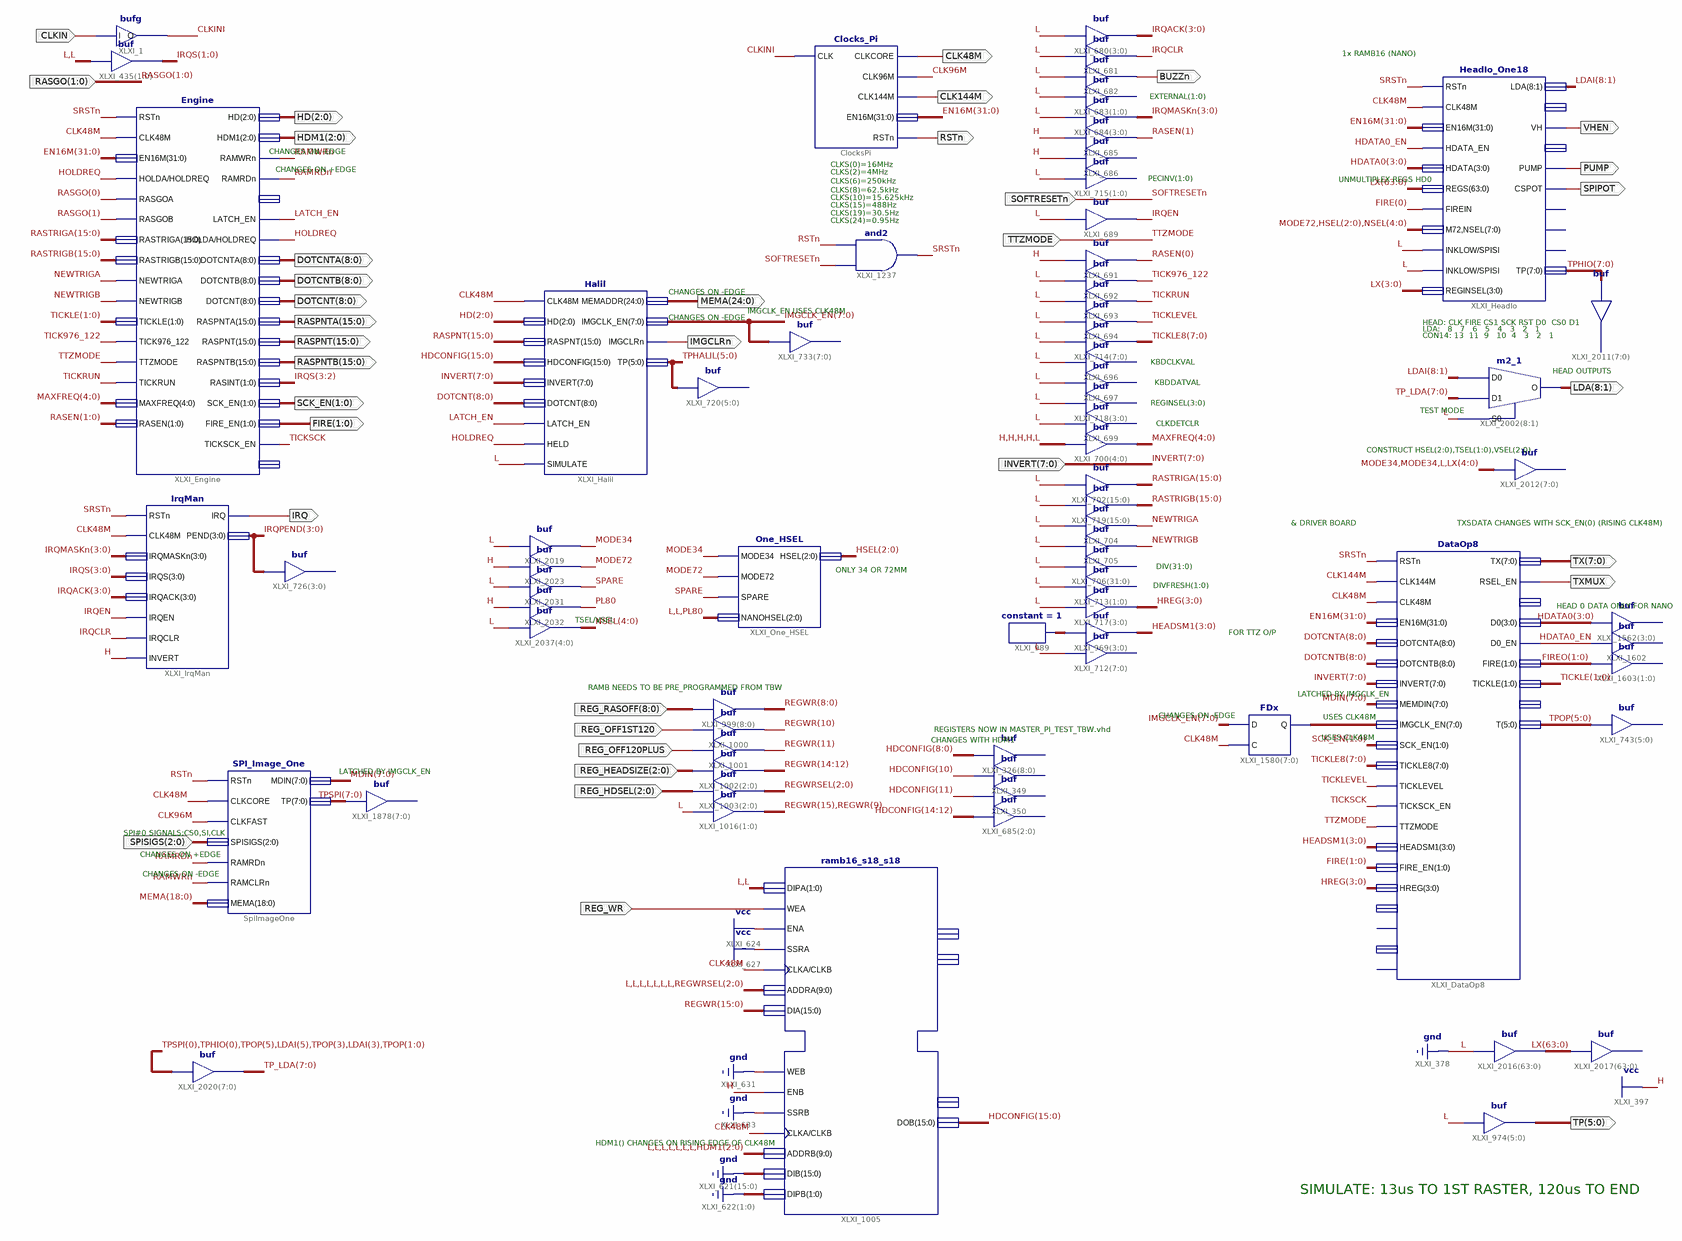
[diagram p0: schematic sheet 1]
// Xilinx ISE schematic One18_Test.sch (spartan3e) as structural Verilog: 72 symbols, 36 ports
module One18_Test (
  input  [7:0] INVERT,
  input  TTZMODE,
  input  CLKIN,
  input  SOFTRESETn,
  input  [1:0] RASGO,
  input  [2:0] SPISIGS,
  input  REG_WR,
  input  [8:0] REG_RASOFF,
  input  REG_OFF1ST120,
  input  REG_OFF120PLUS,
  input  [2:0] REG_HEADSIZE,
  input  [2:0] REG_HDSEL,
  output CLK48M,
  output RSTn,
  output [2:0] HD,
  output [15:0] RASPNT,
  output [8:0] DOTCNT,
  output BUZZn,
  output [1:0] FIRE,
  output [8:0] DOTCNTA,
  output [1:0] SCK_EN,
  output [8:0] DOTCNTB,
  output CLK144M,
  output [7:0] TX,
  output TXMUX,
  output [5:0] TP,
  output [2:0] HDM1,
  output [15:0] RASPNTA,
  output [15:0] RASPNTB,
  output IRQ,
  output [8:1] LDA,
  output VHEN,
  output SPIPOT,
  output PUMP,
  output [24:0] MEMA,
  output IMGCLRn
);

  wire CLK96M, CLKINI, HDATA0_EN, HOLDREQ, IRQCLR, IRQEN, LATCH_EN, MODE34, MODE72, NEWTRIGA, NEWTRIGB, PL80,
       RAMRDn, RAMWRn, SPARE, SRSTn, TICK976_122, TICKLEVEL, TICKRUN, TICKSCK;
  wire [1:0] FIREO, RASEN, TICKLE;
  wire [2:0] HSEL, REGWRSEL;
  wire [3:0] HDATA0, HEADSM1, HREG, IRQACK, IRQMASKn, IRQPEND, IRQS, XLXN_2174;
  wire [4:0] MAXFREQ, NSEL;
  wire [5:0] TPHALIL, TPOP;
  wire [7:0] IMGCLK_EN, MDIN, TICKLE8, TP_LDA, TPHIO, TPSPI, XLXN_2261;
  wire [8:1] LDAI;
  wire [15:0] HDCONFIG, RASTRIGA, RASTRIGB, REGWR;
  wire [31:0] EN16M;
  wire [63:0] LX;

  assign IRQACK = 4'b0000;  // buf XLXI_680[3..0], 4 bits wide
  buf XLXI_681 (IRQCLR, 1'b0);
  buf XLXI_682 (BUZZn, 1'b0);
  // buf XLXI_683[1..0] has open pins: I=1'b0, O=open
  assign IRQMASKn = 4'b0000;  // buf XLXI_684[3..0], 4 bits wide
  buf XLXI_685 (RASEN[1], 1'b1);
  // buf XLXI_686 has open pins: I=1'b1, O=open
  buf XLXI_689 (IRQEN, 1'b0);
  buf XLXI_691 (RASEN[0], 1'b1);
  buf XLXI_692 (TICK976_122, 1'b0);
  buf XLXI_693 (TICKRUN, 1'b0);
  // buf XLXI_699 has open pins: I=1'b0, O=open
  assign RASTRIGA = {16{1'b0}};  // buf XLXI_702[15..0], 16 bits wide
  buf XLXI_704 (NEWTRIGA, 1'b0);
  buf XLXI_705 (NEWTRIGB, 1'b0);
  // buf XLXI_706[31..0] has open pins: I=1'b0, O=open
  // buf XLXI_715[1..0] has open pins: I=1'b0, O=open
  buf XLXI_694 (TICKLEVEL, 1'b0);
  assign TICKLE8 = {8{1'b0}};  // buf XLXI_714[7..0], 8 bits wide
  assign MAXFREQ = 5'b11110;  // buf XLXI_700[4..0], 5 bits wide
  assign RASTRIGB = {16{1'b0}};  // buf XLXI_719[15..0], 16 bits wide
  // buf XLXI_713[1..0] has open pins: I=1'b0, O=open
  assign HREG = 4'b0000;  // buf XLXI_717[3..0], 4 bits wide
  assign IRQS[1:0] = 2'b00;  // buf XLXI_435[1..0], 2 bits wide
  bufg XLXI_1 (.I(CLKIN), .O(CLKINI));
  // buf XLXI_712[7..0] has open pins: I=1'b0, O=open
  assign HEADSM1 = XLXN_2174;  // buf XLXI_969[3..0], 4 bits wide
  // buf XLXI_718[3..0] has open pins: I=1'b0, O=open
  // buf XLXI_697 has open pins: I=1'b0, O=open
  // buf XLXI_696 has open pins: I=1'b0, O=open
  constant #(.CValue("1")) XLXI_989 (.O(XLXN_2174));
  assign TP = {6{1'b0}};  // buf XLXI_974[5..0], 6 bits wide
  IrqMan XLXI_IrqMan (
    .CLK48M(CLK48M), .IRQ(IRQ), .IRQACK(IRQACK), .IRQCLR(IRQCLR), .IRQEN(IRQEN), .IRQMASKn(IRQMASKn),
    .IRQS(IRQS), .PEND(IRQPEND), .RSTn(SRSTn), .INVERT(1'b1));
  // buf XLXI_726[3..0] has open pins: I=IRQPEND, O=open
  Clocks_Pi ClocksPi (.CLK(CLKINI), .CLK144M(CLK144M), .CLK96M(CLK96M), .CLKCORE(CLK48M), .EN16M(EN16M), .RSTn(RSTn));
  and XLXI_1237 (SRSTn, SOFTRESETn, RSTn);
  // buf XLXI_1562[3..0] has open pins: I=HDATA0, O=open
  // buf XLXI_1602 has open pins: I=HDATA0_EN, O=open
  // buf XLXI_1603[1..0] has open pins: I=FIREO, O=open
  // buf XLXI_743[5..0] has open pins: I=TPOP, O=open
  DataOp8 XLXI_DataOp8 (
    .CLK144M(CLK144M), .CLK48M(CLK48M), .D0(HDATA0), .D0_EN(HDATA0_EN), .DOTCNTA(DOTCNTA), .DOTCNTB(DOTCNTB),
    .EN16M(EN16M), .FIRE(FIREO), .FIRE_EN(FIRE), .HEADSM1(HEADSM1), .HREG(HREG), .IMGCLK_EN(XLXN_2261),
    .INVERT(INVERT), .MEMDIN(MDIN), .RSEL_EN(TXMUX), .RSTn(SRSTn), .SCK_EN(SCK_EN), .T(TPOP),
    .TICKLE(TICKLE), .TICKLE8(TICKLE8), .TICKLEVEL(TICKLEVEL), .TICKSCK_EN(TICKSCK), .TTZMODE(TTZMODE),
    .TX(TX));  // open: RSALLOW, RSEL, RSRXSTAT, RSTXEN, RSTXHD, TWOCHAN
  SPI_Image_One SpiImageOne (
    .CLKCORE(CLK48M), .CLKFAST(CLK96M), .MDIN(MDIN), .MEMA(MEMA[18:0]), .RAMCLRn(RAMWRn), .RAMRDn(RAMRDn),
    .RSTn(RSTn), .SPISIGS(SPISIGS), .TP(TPSPI));
  m2_1 XLXI_2002[8:1] (.D0(LDAI), .D1(TP_LDA), .S0(1'b0), .O(LDA));
  // buf XLXI_2012[7..0] has open pins: I={{2{MODE34}}, 1'b0, LX[4:0]}, O=open
  // buf XLXI_1878[7..0] has open pins: I=TPSPI, O=open
  assign LX = {64{1'b0}};  // buf XLXI_2016[63..0], 64 bits wide
  // buf XLXI_2017[63..0] has open pins: I=LX, O=open
  Engine XLXI_Engine (
    .CLK48M(CLK48M), .DOTCNT(DOTCNT), .DOTCNTA(DOTCNTA), .DOTCNTB(DOTCNTB), .EN16M(EN16M), .FIRE_EN(FIRE),
    .HD(HD), .HDM1(HDM1), .HOLDA(HOLDREQ), .HOLDREQ(HOLDREQ), .LATCH_EN(LATCH_EN), .MAXFREQ(MAXFREQ),
    .NEWTRIGA(NEWTRIGA), .NEWTRIGB(NEWTRIGB), .RAMWRn(RAMWRn), .RAMRDn(RAMRDn), .RASEN(RASEN),
    .RASGOA(RASGO[0]), .RASGOB(RASGO[1]), .RASINT(IRQS[3:2]), .RASPNT(RASPNT), .RASPNTA(RASPNTA),
    .RASPNTB(RASPNTB), .RASTRIGA(RASTRIGA), .RASTRIGB(RASTRIGB), .RSTn(SRSTn), .SCK_EN(SCK_EN),
    .TICK976_122(TICK976_122), .TICKLE(TICKLE), .TICKRUN(TICKRUN), .TICKSCK_EN(TICKSCK), .TTZMODE(TTZMODE));  // open: RASGO_EN, TP
  ramb16_s18_s18 XLXI_1005 (
    .ADDRA({{7{1'b0}}, REGWRSEL}), .ADDRB({{7{1'b0}}, HDM1}), .CLKA(CLK48M), .CLKB(CLK48M), .DIA(REGWR),
    .DIB({16{1'b0}}), .DIPA(2'b00), .DIPB(2'b00), .ENA(1'b1), .ENB(1'b1), .SSRA(1'b1), .SSRB(1'b0),
    .WEA(REG_WR), .WEB(1'b0), .DOB(HDCONFIG));  // open: DOA, DOPA, DOPB
  // buf XLXI_350 has open pins: I=HDCONFIG[11], O=open
  // buf XLXI_349 has open pins: I=HDCONFIG[10], O=open
  // buf XLXI_685[2..0] has open pins: I=HDCONFIG[14:12], O=open
  // buf XLXI_326[8..0] has open pins: I=HDCONFIG[8:0], O=open
  assign REGWR[8:0] = REG_RASOFF;  // buf XLXI_999[8..0], 9 bits wide
  buf XLXI_1000 (REGWR[10], REG_OFF1ST120);
  buf XLXI_1001 (REGWR[11], REG_OFF120PLUS);
  assign REGWR[14:12] = REG_HEADSIZE;  // buf XLXI_1002[2..0], 3 bits wide
  assign REGWRSEL = REG_HDSEL;  // buf XLXI_1003[2..0], 3 bits wide
  assign {REGWR[15], REGWR[9]} = 2'b00;  // buf XLXI_1016[1..0], 2 bits wide
  FDx XLXI_1580[7:0] (.C(CLK48M), .D(IMGCLK_EN), .Q(XLXN_2261));
  assign TP_LDA = {TPSPI[0], TPHIO[0], TPOP[5], LDAI[5], TPOP[3], LDAI[3], TPOP[1:0]};  // buf XLXI_2020[7..0], 8 bits wide
  HeadIo_One18 XLXI_HeadIo (
    .CLK48M(CLK48M), .CSPOT(SPIPOT), .EN16M(EN16M), .FIREIN(FIRE[0]), .HDATA(HDATA0), .HDATA_EN(HDATA0_EN),
    .INKLOW(1'b0), .LDA(LDAI), .M72(MODE72), .NSEL({HSEL, NSEL}), .PUMP(PUMP), .REGINSEL(LX[3:0]), .REGS(LX),
    .RSTn(SRSTn), .SPISI(1'b0), .TP(TPHIO), .VH(VHEN));  // open: CSTHM, REGIN, SCON, SPICK, SPISO
  // buf XLXI_2011[7..0] has open pins: I=TPHIO, O=open
  // buf XLXI_720[5..0] has open pins: I=TPHALIL, O=open
  // buf XLXI_733[7..0] has open pins: I=IMGCLK_EN, O=open
  Halil XLXI_Halil (
    .CLK48M(CLK48M), .DOTCNT(DOTCNT), .HD(HD), .HDCONFIG(HDCONFIG), .HELD(HOLDREQ), .IMGCLK_EN(IMGCLK_EN),
    .IMGCLRn(IMGCLRn), .INVERT(INVERT), .LATCH_EN(LATCH_EN), .MEMADDR(MEMA), .RASPNT(RASPNT),
    .SIMULATE(1'b0), .TP(TPHALIL));
  One_HSEL XLXI_One_HSEL (.HSEL(HSEL), .MODE34(MODE34), .MODE72(MODE72), .NANOHSEL({2'b00, PL80}), .SPARE(SPARE));
  buf XLXI_2019 (MODE34, 1'b0);
  buf XLXI_2023 (MODE72, 1'b1);
  buf XLXI_2031 (SPARE, 1'b0);
  buf XLXI_2032 (PL80, 1'b1);
  assign NSEL = {5{1'b0}};  // buf XLXI_2037[4..0], 5 bits wide

  // Notes on the sheet:
  //   1x RAMB16 (NANO)
  //   EXTERNAL(1:0)
  //   CHANGES ON -EDGE
  //   CLKS(0)=16MHz
  //   CHANGES ON +EDGE
  //   CLKS(2)=4MHz
  //   PECINV(1:0)
  //   UNMULTIPLEX REGS HD0
  //   CLKS(6)=250kHz
  //   CLKS(8)=62.5kHz
  //   CLKS(10)=15.625kHz
  //   CLKS(15)=488Hz
  //   CLKS(19)=30.5Hz
  //   CLKS(24)=0.95Hz
  //   CHANGES ON -EDGE
  //   IMGCLK_EN USES CLK48M
  //   CHANGES ON -EDGE
  //   HEAD: CLK FIRE CS1 SCK RST D0  CS0 D1
  //   LDA:   8   7   6   5   4   3   2   1
  //   CON14: 13  11  9   10  4   3   2   1
  //   KBDCLKVAL
  //   HEAD OUTPUTS
  //   KBDDATVAL
  //   REGINSEL(3:0)
  //   TEST MODE
  //   CLKDETCLR
  //   CONSTRUCT HSEL(2:0),TSEL(1:0),VSEL(2:0)
  //   & DRIVER BOARD
  //   TXSDATA CHANGES WITH SCK_EN(0) (RISING CLK48M)
  //   DIV(31:0)
  //   ONLY 34 OR 72MM
  //   DIVFRESH(1:0)
  //   HEAD 0 DATA ONLY FOR NANO
  //   TSEL/VSEL
  //   FOR TTZ O/P
  //   RAMB NEEDS TO BE PRE_PROGRAMMED FROM TBW
  //   LATCHED BY IMGCLK_EN
  //   CHANGES ON -EDGE
  //   USES CLK48M
  //   REGISTERS NOW IN MASTER_PI_TEST_TBW.vhd
  //   USES CLK48M
  //   CHANGES WITH HDM1
  //   LATCHED BY IMGCLK_EN
  //   SPI#0 SIGNALS:CS0,SI,CLK
  //   CHANGES ON +EDGE
  //   CHANGES ON -EDGE
  //   HDM1() CHANGES ON RISING EDGE OF CLK48M
  //   SIMULATE: 13us TO 1ST RASTER, 120us TO END
endmodule
